# Altium schematic sheet Reducteur_tension.SchDoc: Réducteur de tension
size A4; DrawnBy: Erwan Menard; Revision: V0.1 Rev A; SheetNumber: 5; SheetTotal: 9
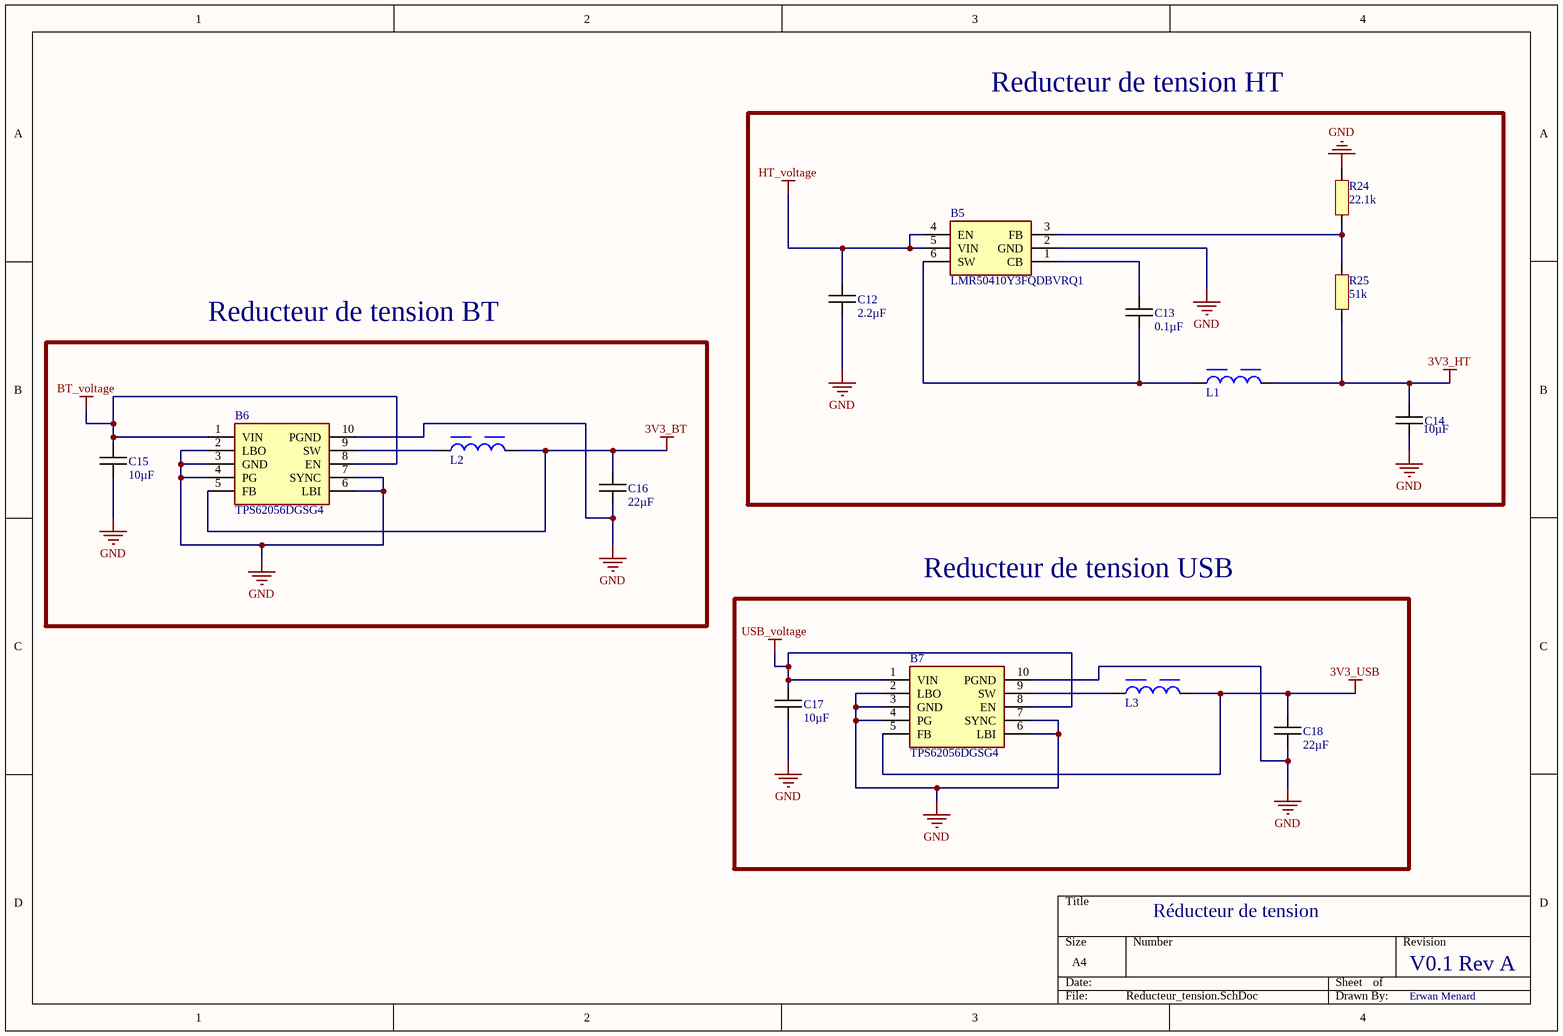
[diagram p0: Reducteur_tension.SchDoc]

## Parts
B5  LMR50410Y3FQDBVRQ1  [SOT95P280X145-6N]
B6  TPS62056DGSG4  [SOP50P490X110-10N]
B7  TPS62056DGSG4  [SOP50P490X110-10N]
C12  2.2µF  [CAPC1005X06N]
C13  0.1µF  [CAPC1005X06N]
C14  10µF  [CAPC1005X06N]
C15  10µF  [CAPC1005X06N]
C16  22µF  [CAPC1005X06N]
C17  10µF  [CAPC1005X06N]
C18  22µF  [CAPC1005X06N]
L1  3.3uH, 3.5A  [WE-LHMI_4020]  (value not drawn)
L2  10uH, 3.5A  [WE-LHMI_4020]  (value not drawn)
L3  10uH, 3.5A  [WE-LHMI_4020]  (value not drawn)
R24  22.1k  [RESC1005X06N]
R25  51k  [RESC1005X06N]

## Blocks framed on the sheet
Reducteur de tension HT: B5 C12-C14 L1 R24 R25
Reducteur de tension BT: B6 C15 C16 L2
Reducteur de tension USB: B7 C17 C18 L3

## Nets
3V3_BT: B6.5(FB) C16.1 L2.2
3V3_HT: C14.1 L1.2 R25.1
3V3_USB: B7.5(FB) C18.1 L3.2
BT_voltage: B6.1(VIN) B6.8(EN) C15.1
GND: B5.2(GND) B6.2(LBO) B6.3(GND) B6.4(PG) B6.6(LBI) B6.7(SYNC) B6.10(PGND) B7.2(LBO) B7.3(GND) B7.4(PG) B7.6(LBI) B7.7(SYNC) B7.10(PGND) C12.2 C14.2 C15.2 C16.2 C17.2 C18.2 R24.2
HT_voltage: B5.4(EN) B5.5(VIN) C12.1
USB_voltage: B7.1(VIN) B7.8(EN) C17.1
NetB5_1: B5.1(CB) C13.1
NetB5_3: B5.3(FB) R24.1 R25.2
NetB5_6: B5.6(SW) C13.2 L1.1
NetB6_9: B6.9(SW) L2.1
NetB7_9: B7.9(SW) L3.1

## Library data of the parts
B5 = LMR50410Y3FQDBVRQ1: Régulateurs de tension de commutation Automotive qualified SIMPLE SWITCHER 4-V to 36-V, 1-A synchronous step-down converter 6-SOT-23 -40 to 150; Manufacturer_Name: Texas Instruments; Manufacturer_Part_Number: LMR50410Y3FQDBVRQ1; Mouser Part Number: 595-R50410Y3FQDBVRQ1
B6 B7 = TPS62056DGSG4: TEXAS INSTRUMENTS - TPS62056DGSG4 - Synchronous Buck (Step Down) Switching Regulator, Fixed, 2.7V-10Vin, 3.3V/0.8A out, 850kHz, VSSOP-10; Manufacturer_Name: Texas Instruments; Manufacturer_Part_Number: TPS62056DGSG4; Mouser Part Number: 595-TPS62056DGSG4
C12-C18 = Capacitor
L1-L3 = 74437324033: WE-LHMI SMT Power Inductor, size 4020, 3.3uH, 3.5A, 76mOhm; Manufacturer: Wurth Elektronik; Case/Size Code: 4020; DC Resistance: 69mOhm; Saturation Current @ 10%: 2.75A; Saturation Current @ 30%: 5.45A; Self Resonant Frequency: 40MHz; Manufacturer Part Number: 74437324033; Category: Power Inductors; Match Code: WE-LHMI; ComponentLink1Description: Website Link; ComponentLink1URL: https://www.we-online.com/redexpert/article/74437324033?ad; ComponentLink2Description: Datasheet Link; ComponentLink2URL: https://www.we-online.com/redexpert/spec/74437324033?ad; Mount: Surface Mount; Operating Temperature Max: 125°C; Operating Temperature Min: -40°C; Packaging: Tape and Reel; Length: 4.06mm; Width: 4.06mm; Height: 1.8mm; DC Resistance Max: 76mOhm; Inductance: 3.3uH; Performance Rated Current: 3.5A
R24 R25 = Resistor